# EasyEDA Pro project YanXi_Project.eprj, schematic PayloadBoard

## Sheets
1 电调主控: Create Date: 2023-04-20; Page Name: 电调主控; Project Name: YanXi_Project; Schematic Name: PayloadBoard; Update Date: 2023-07-10; Company: 嘉立创EDA; Drawed: WANG BIN; Page Size: A4; Version: V1.0
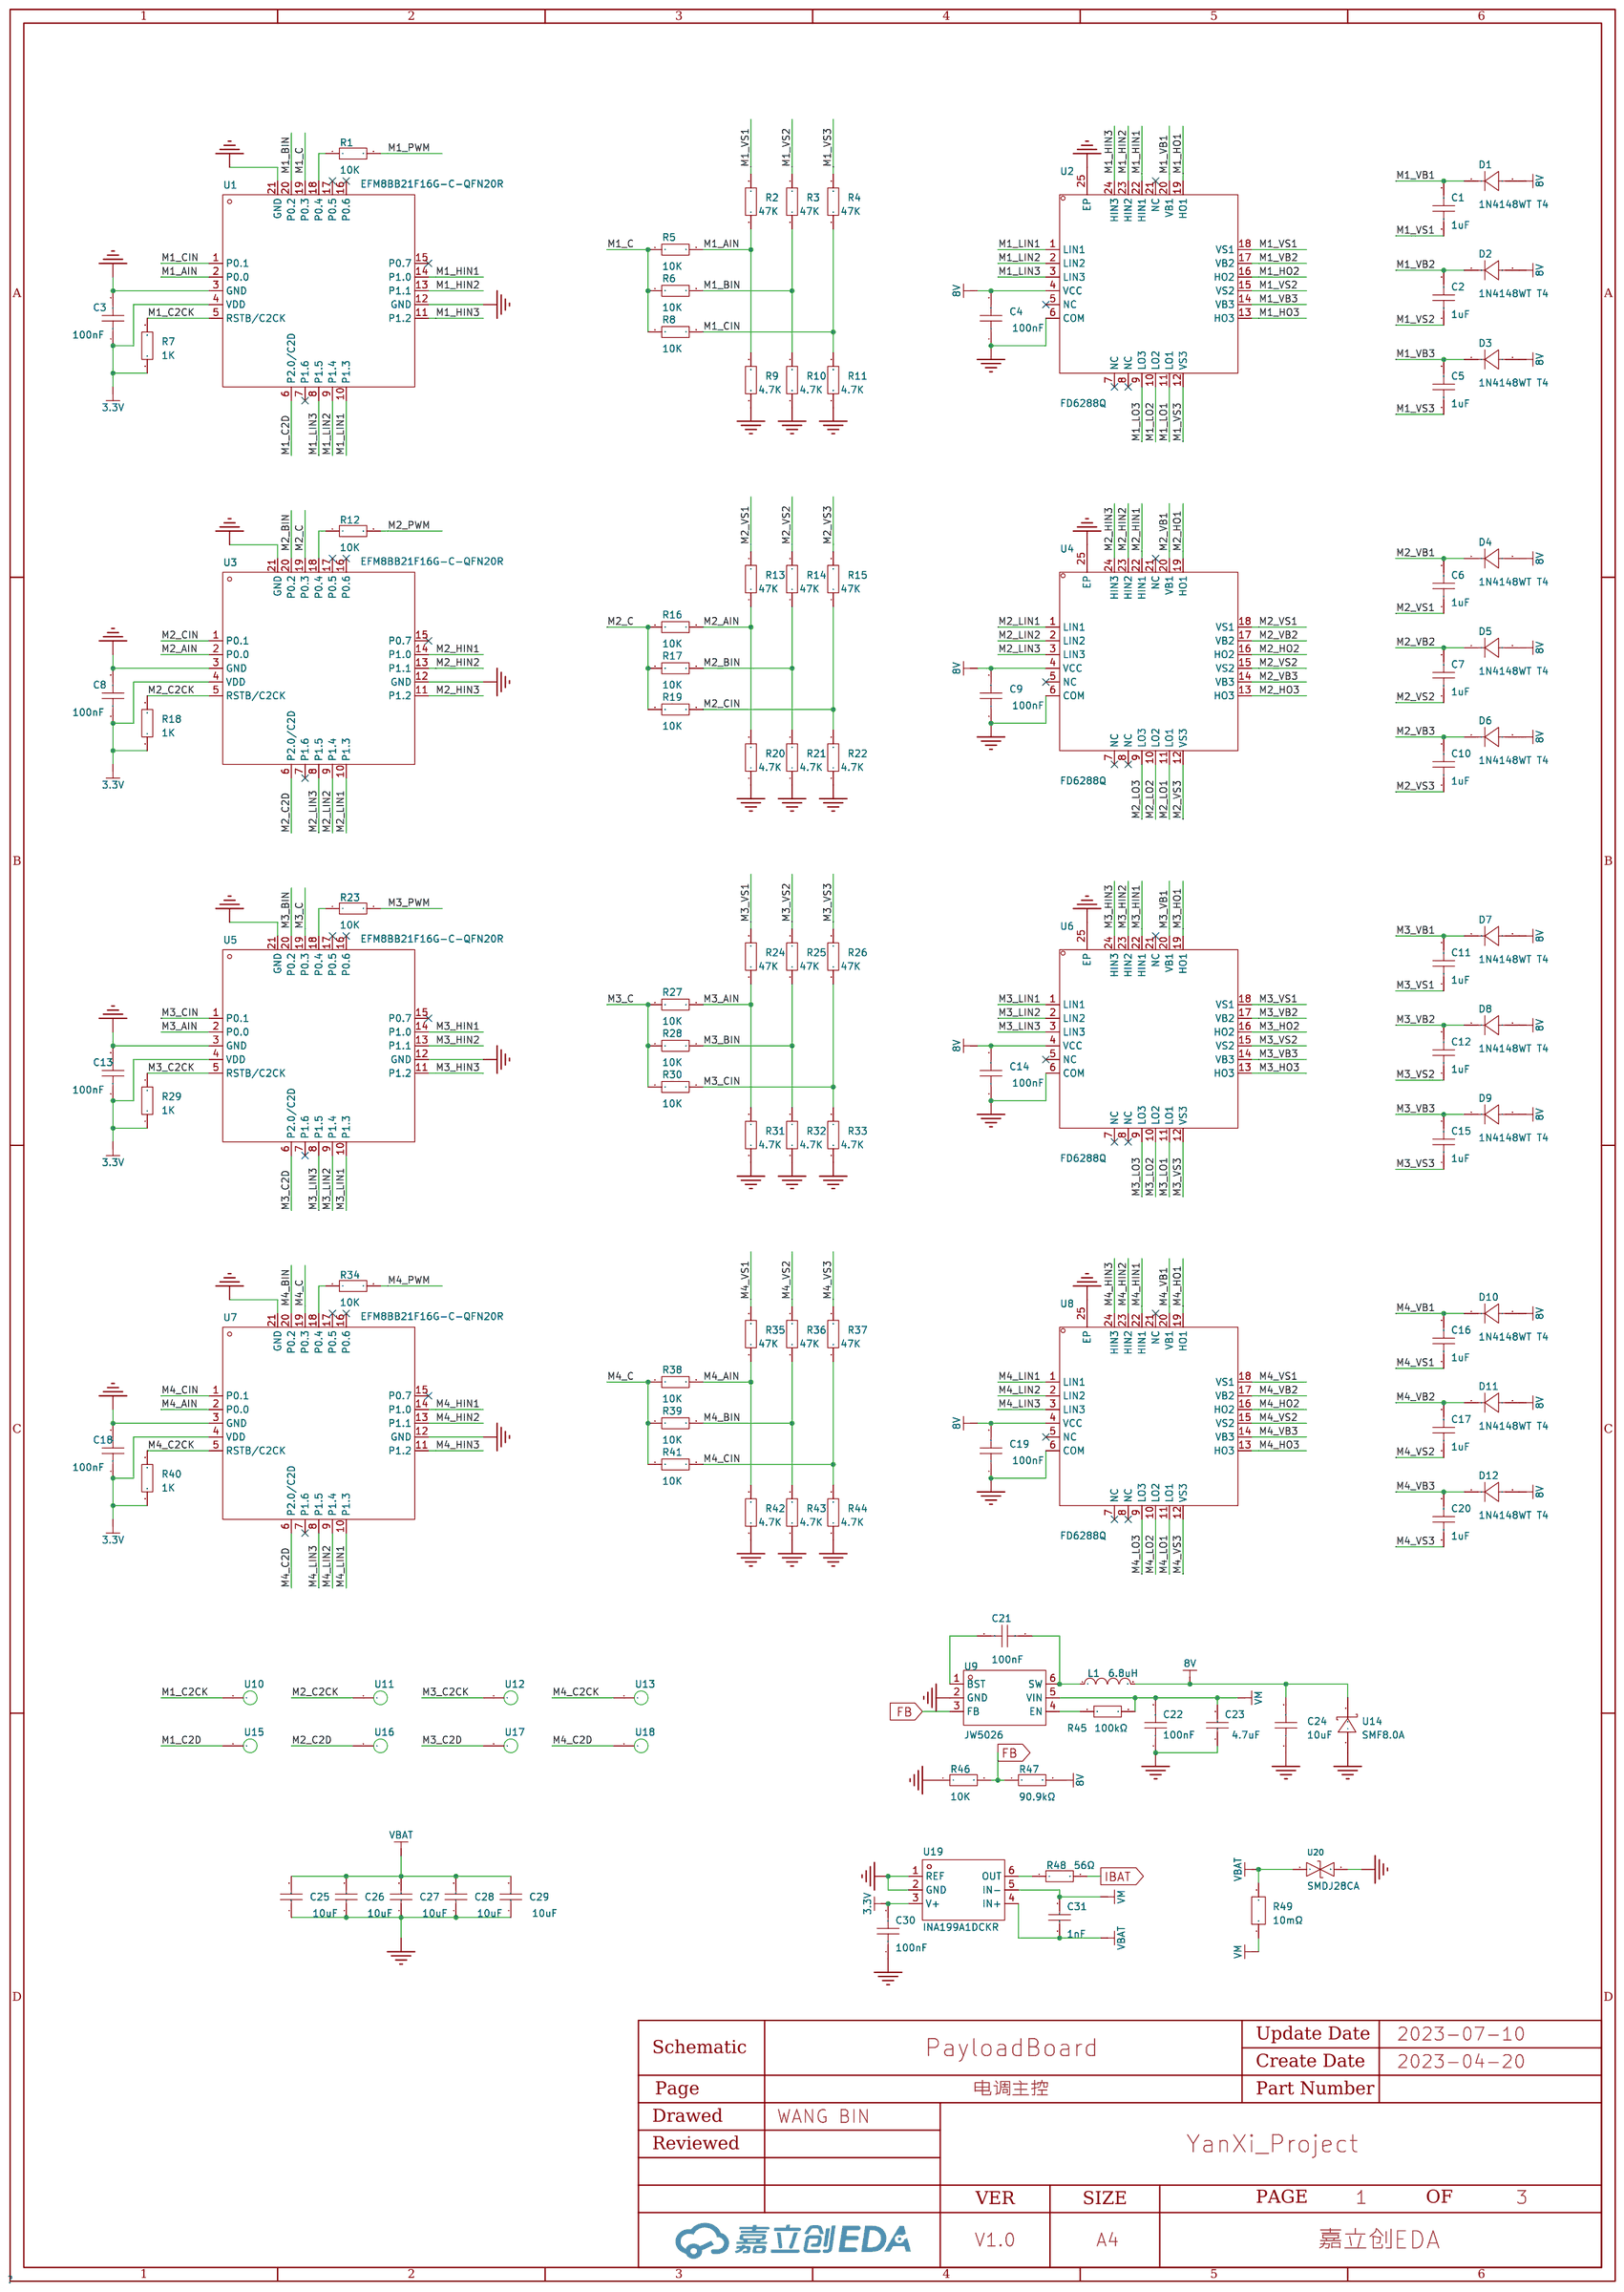
[diagram p0: 电调主控]
2 接插件: Page Name: 接插件; Update Date: 2023-07-11
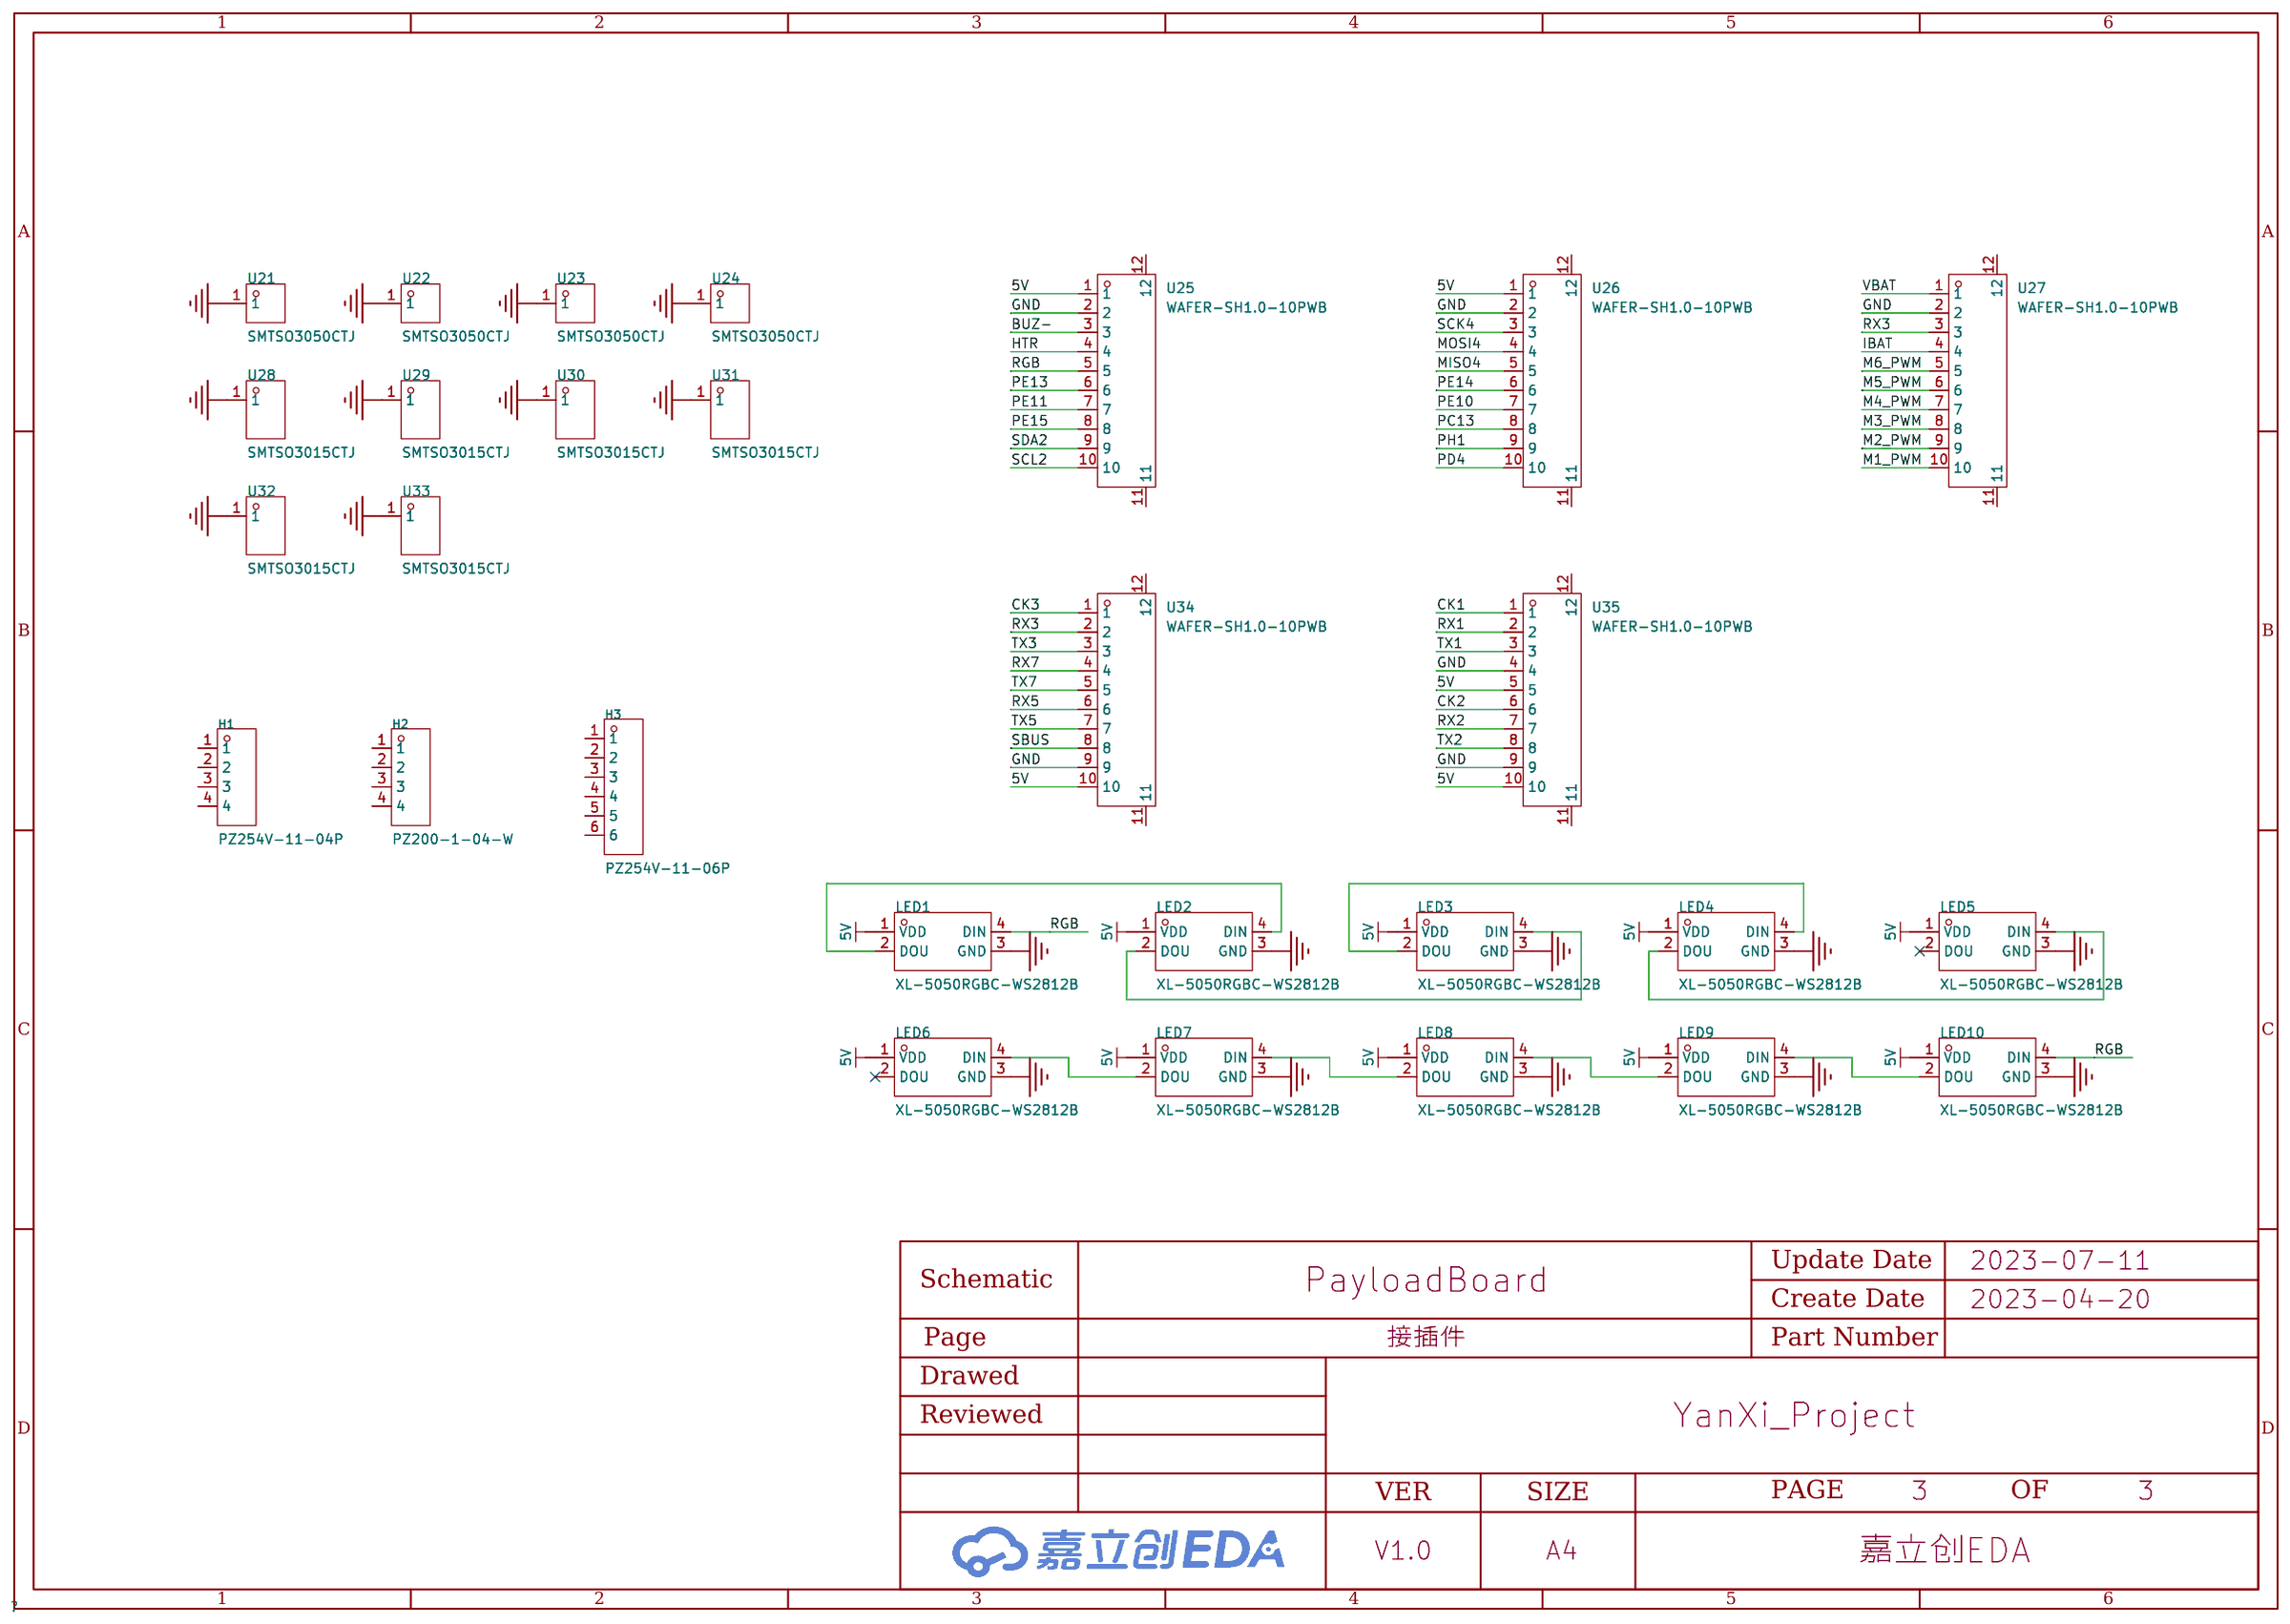
[diagram p1: 接插件]
3 电调驱动: Create Date: 2023-07-10; Page Name: 电调驱动
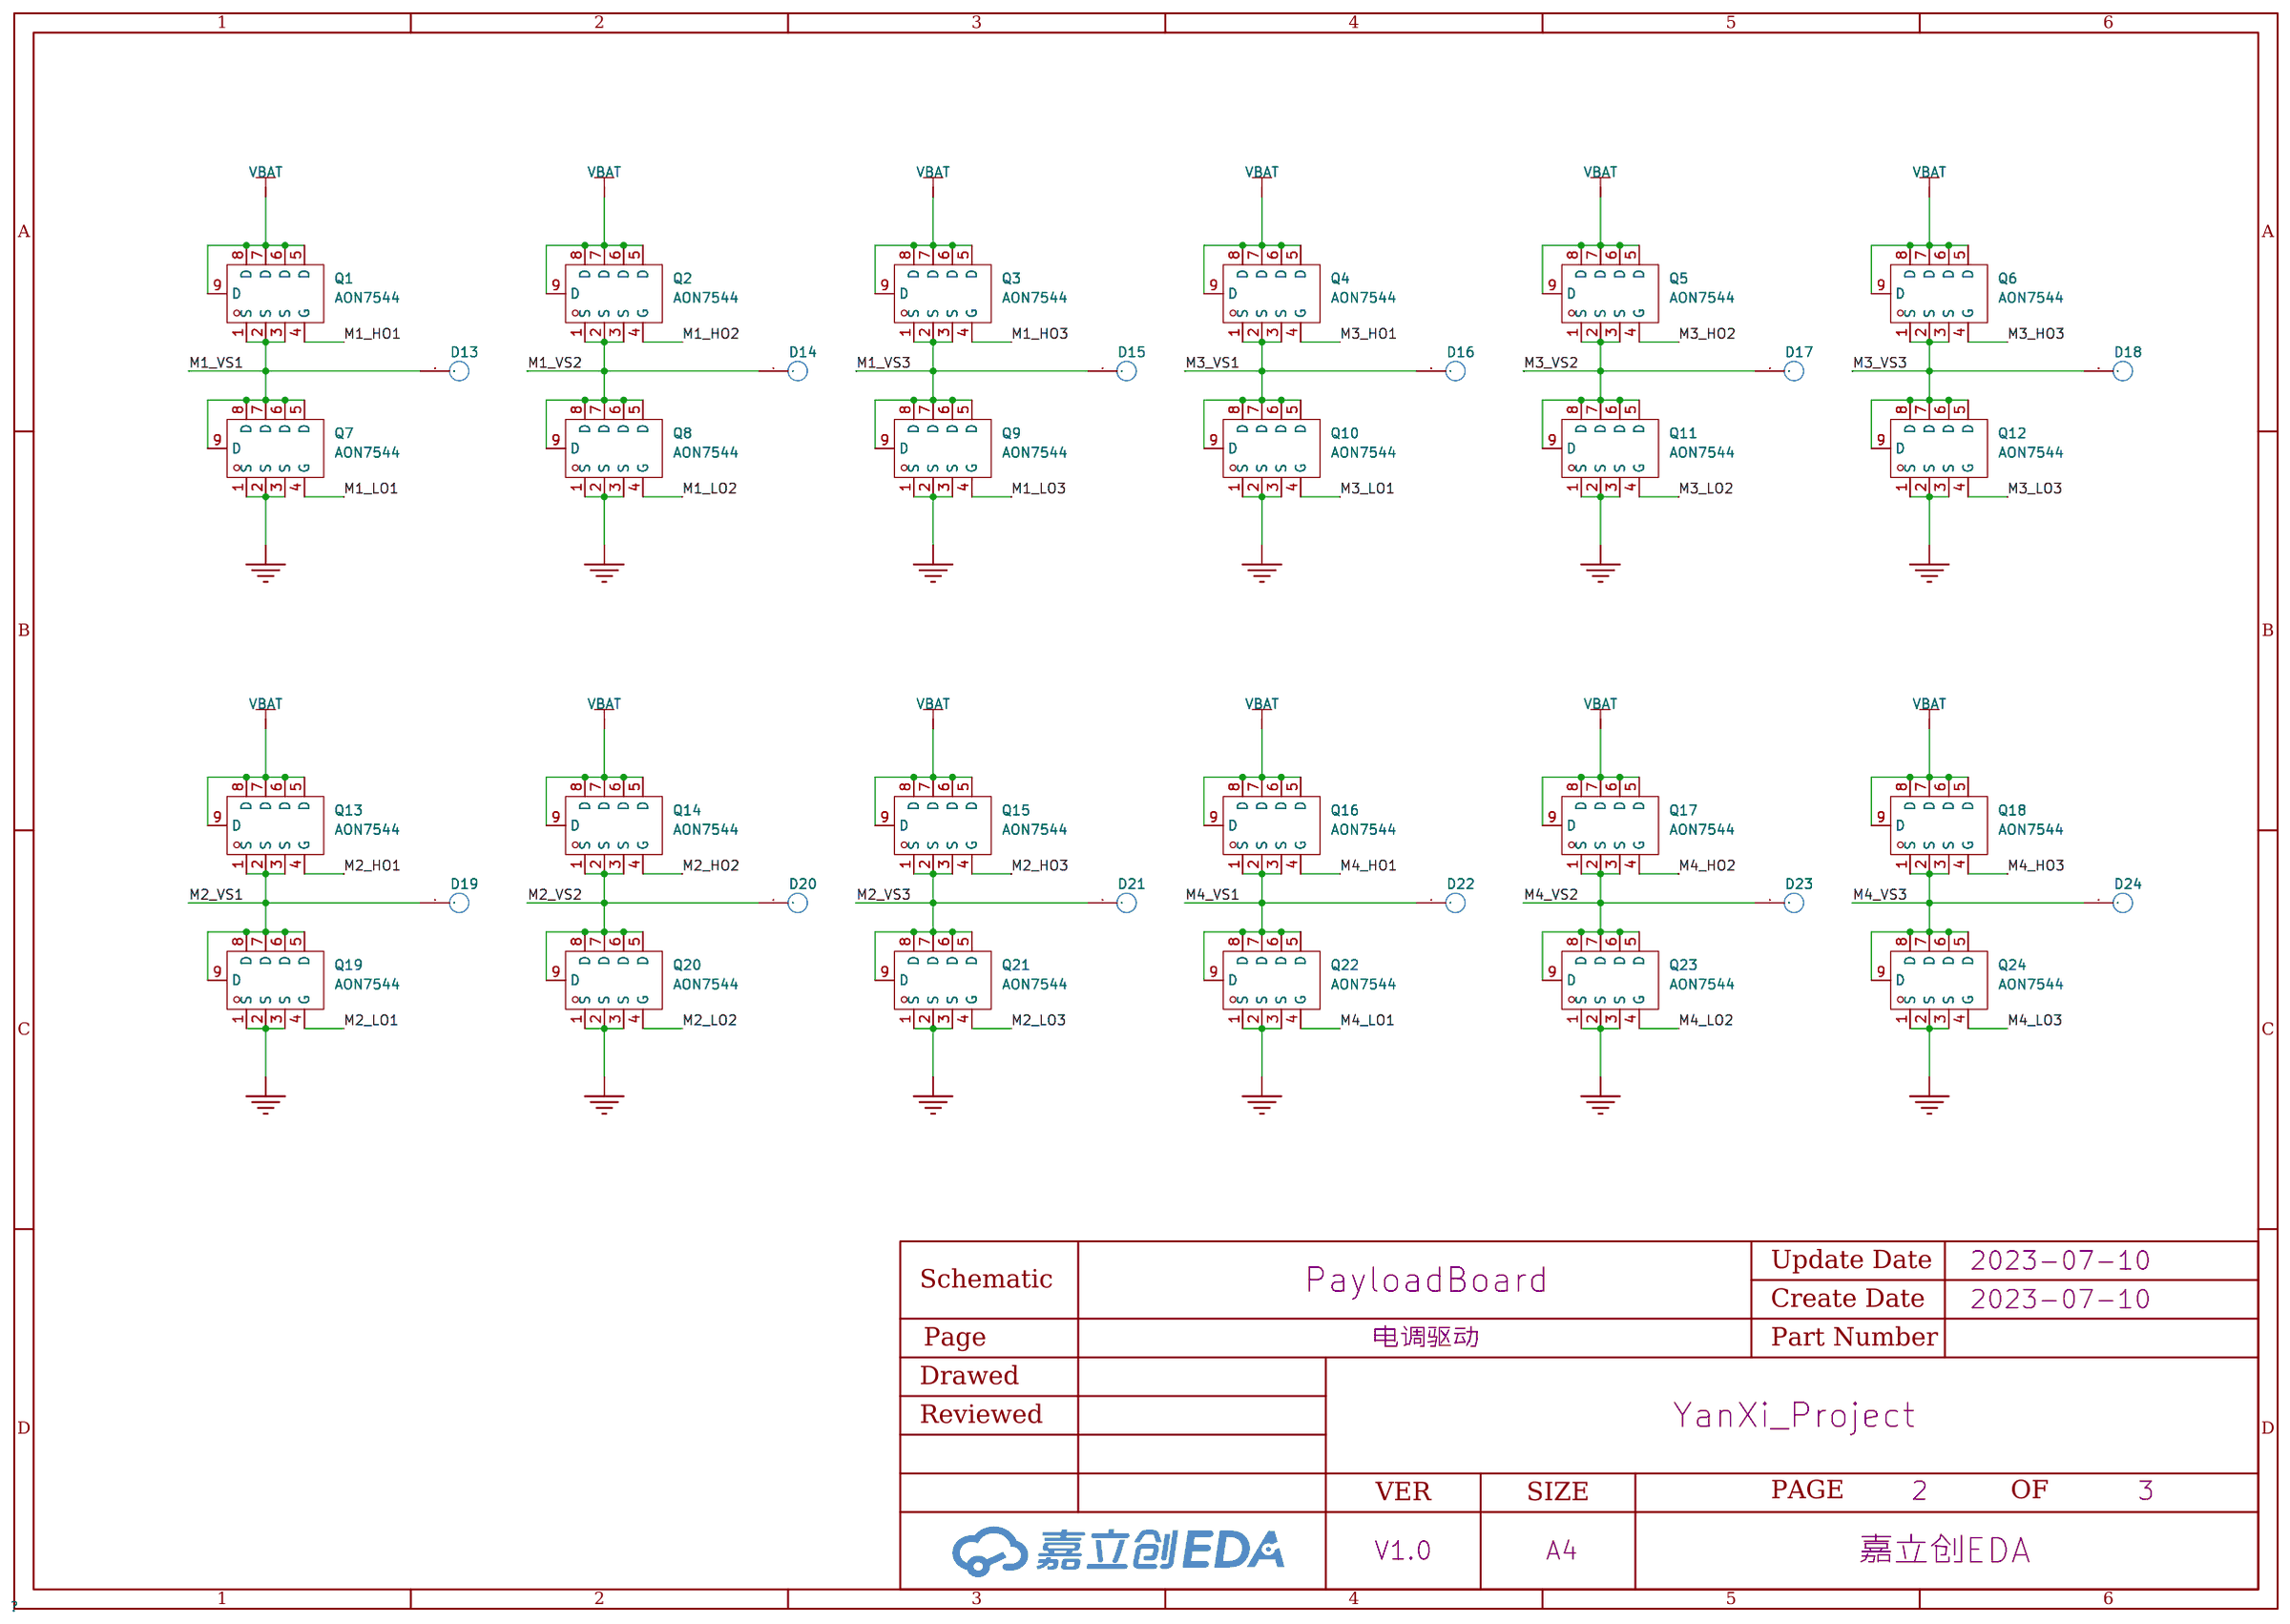
[diagram p2: 电调驱动]

## Parts
sheet 接插件
H1  PZ254V-11-04P  [HDR-TH_4P-P2.54-V-M]
H2  PZ200-1-04-W  [HDR-TH_4P-P2.00-H-M-W7.2-N]
H3  PZ254V-11-06P  [HDR-TH_6P-P2.54-V-M]
LED1  XL-5050RGBC-WS2812B  [LED-SMD_4P-L5.0-W5.0-BL_XL-5050RGBC]
LED2  XL-5050RGBC-WS2812B  [LED-SMD_4P-L5.0-W5.0-BL_XL-5050RGBC]
LED3  XL-5050RGBC-WS2812B  [LED-SMD_4P-L5.0-W5.0-BL_XL-5050RGBC]
LED4  XL-5050RGBC-WS2812B  [LED-SMD_4P-L5.0-W5.0-BL_XL-5050RGBC]
LED5  XL-5050RGBC-WS2812B  [LED-SMD_4P-L5.0-W5.0-BL_XL-5050RGBC]
LED6  XL-5050RGBC-WS2812B  [LED-SMD_4P-L5.0-W5.0-BL_XL-5050RGBC]
LED7  XL-5050RGBC-WS2812B  [LED-SMD_4P-L5.0-W5.0-BL_XL-5050RGBC]
LED8  XL-5050RGBC-WS2812B  [LED-SMD_4P-L5.0-W5.0-BL_XL-5050RGBC]
LED9  XL-5050RGBC-WS2812B  [LED-SMD_4P-L5.0-W5.0-BL_XL-5050RGBC]
LED10  XL-5050RGBC-WS2812B  [LED-SMD_4P-L5.0-W5.0-BL_XL-5050RGBC]
U21  SMTSO3050CTJ  [SMD_SMTSO3060CTJ]
U22  SMTSO3050CTJ  [SMD_SMTSO3060CTJ]
U23  SMTSO3050CTJ  [SMD_SMTSO3060CTJ]
U24  SMTSO3050CTJ  [SMD_SMTSO3060CTJ]
U25  WAFER-SH1.0-10PWB  [CONN-SMD_10P-P1.00_WAFER-SH1.0-10PWB]
U26  WAFER-SH1.0-10PWB  [CONN-SMD_10P-P1.00_WAFER-SH1.0-10PWB]
U27  WAFER-SH1.0-10PWB  [CONN-SMD_10P-P1.00_WAFER-SH1.0-10PWB]
U28  SMTSO3015CTJ  [SMD_BD5.6-L5.6-W5.6-D4.1]
U29  SMTSO3015CTJ  [SMD_BD5.6-L5.6-W5.6-D4.1]
U30  SMTSO3015CTJ  [SMD_BD5.6-L5.6-W5.6-D4.1]
U31  SMTSO3015CTJ  [SMD_BD5.6-L5.6-W5.6-D4.1]
U32  SMTSO3015CTJ  [SMD_BD5.6-L5.6-W5.6-D4.1]
U33  SMTSO3015CTJ  [SMD_BD5.6-L5.6-W5.6-D4.1]
U34  WAFER-SH1.0-10PWB  [CONN-SMD_10P-P1.00_WAFER-SH1.0-10PWB]
U35  WAFER-SH1.0-10PWB  [CONN-SMD_10P-P1.00_WAFER-SH1.0-10PWB]
sheet 电调主控
C1  1uF  [C0402]
C2  1uF  [C0402]
C3  100nF  [C0402_NEW]
C4  100nF  [C0402_NEW]
C5  1uF  [C0402]
C6  1uF  [C0402]
C7  1uF  [C0402]
C8  100nF  [C0402_NEW]
C9  100nF  [C0402_NEW]
C10  1uF  [C0402]
C11  1uF  [C0402]
C12  1uF  [C0402]
C13  100nF  [C0402_NEW]
C14  100nF  [C0402_NEW]
C15  1uF  [C0402]
C16  1uF  [C0402]
C17  1uF  [C0402]
C18  100nF  [C0402_NEW]
C19  100nF  [C0402_NEW]
C20  1uF  [C0402]
C21  100nF  [C0402_NEW]
C22  100nF  [C0402_NEW]
C23  4.7uF  [C0603]
C24  10uF  [C0603]
C25  10uF  [C1206]
C26  10uF  [C1206]
C27  10uF  [C1206]
C28  10uF  [C1206]
C29  10uF  [C1206]
C30  100nF  [C0402_NEW]
C31  1nF  [C0402]
D1  1N4148WT T4  [SOD-523_L1.2-W0.8-LS1.6-RD]
D2  1N4148WT T4  [SOD-523_L1.2-W0.8-LS1.6-RD]
D3  1N4148WT T4  [SOD-523_L1.2-W0.8-LS1.6-RD]
D4  1N4148WT T4  [SOD-523_L1.2-W0.8-LS1.6-RD]
D5  1N4148WT T4  [SOD-523_L1.2-W0.8-LS1.6-RD]
D6  1N4148WT T4  [SOD-523_L1.2-W0.8-LS1.6-RD]
D7  1N4148WT T4  [SOD-523_L1.2-W0.8-LS1.6-RD]
D8  1N4148WT T4  [SOD-523_L1.2-W0.8-LS1.6-RD]
D9  1N4148WT T4  [SOD-523_L1.2-W0.8-LS1.6-RD]
D10  1N4148WT T4  [SOD-523_L1.2-W0.8-LS1.6-RD]
D11  1N4148WT T4  [SOD-523_L1.2-W0.8-LS1.6-RD]
D12  1N4148WT T4  [SOD-523_L1.2-W0.8-LS1.6-RD]
L1  6.8uH  [L0805]
R1  10K  [R0402]
R2  47K  [R0402]
R3  47K  [R0402]
R4  47K  [R0402]
R5  10K  [R0402]
R6  10K  [R0402]
R7  1K  [R0402]
R8  10K  [R0402]
R9  4.7K  [R0402]
R10  4.7K  [R0402]
R11  4.7K  [R0402]
R12  10K  [R0402]
R13  47K  [R0402]
R14  47K  [R0402]
R15  47K  [R0402]
R16  10K  [R0402]
R17  10K  [R0402]
R18  1K  [R0402]
R19  10K  [R0402]
R20  4.7K  [R0402]
R21  4.7K  [R0402]
R22  4.7K  [R0402]
R23  10K  [R0402]
R24  47K  [R0402]
R25  47K  [R0402]
R26  47K  [R0402]
R27  10K  [R0402]
R28  10K  [R0402]
R29  1K  [R0402]
R30  10K  [R0402]
R31  4.7K  [R0402]
R32  4.7K  [R0402]
R33  4.7K  [R0402]
R34  10K  [R0402]
R35  47K  [R0402]
R36  47K  [R0402]
R37  47K  [R0402]
R38  10K  [R0402]
R39  10K  [R0402]
R40  1K  [R0402]
R41  10K  [R0402]
R42  4.7K  [R0402]
R43  4.7K  [R0402]
R44  4.7K  [R0402]
R45  100kΩ  [R0402]
R46  10K  [R0402]
R47  90.9kΩ  [R0402]
R48  56Ω  [R0402]
R49  10mΩ  [R1225]
U1  EFM8BB21F16G-C-QFN20R  [QFN-20_L3.0-W3.0-P0.50-BL-EP1.7_EFM8BB21F16G]
U2  FD6288Q  [QFN-24_L4.0-W4.0-P0.50-BL-EP2.6]
U3  EFM8BB21F16G-C-QFN20R  [QFN-20_L3.0-W3.0-P0.50-BL-EP1.7_EFM8BB21F16G]
U4  FD6288Q  [QFN-24_L4.0-W4.0-P0.50-BL-EP2.6]
U5  EFM8BB21F16G-C-QFN20R  [QFN-20_L3.0-W3.0-P0.50-BL-EP1.7_EFM8BB21F16G]
U6  FD6288Q  [QFN-24_L4.0-W4.0-P0.50-BL-EP2.6]
U7  EFM8BB21F16G-C-QFN20R  [QFN-20_L3.0-W3.0-P0.50-BL-EP1.7_EFM8BB21F16G]
U8  FD6288Q  [QFN-24_L4.0-W4.0-P0.50-BL-EP2.6]
U9  JW5026  [SOT-23-6_L2.9-W1.6-P0.95-LS2.8-BR]
U10  -  [烧录点]
U11  -  [烧录点]
U12  -  [烧录点]
U13  -  [烧录点]
U14  SMF8.0A  [SOD-123FL_L2.8-W1.8-LS3.6-RD]
U15  -  [烧录点]
U16  -  [烧录点]
U17  -  [烧录点]
U18  -  [烧录点]
U19  INA199A1DCKR  [SC-70-6_L2.2-W1.3-P0.65-LS2.1-BR]
U20  SMDJ28CA  [SMC_L6.9-W5.9-LS7.9-BI]
sheet 电调驱动
D13  -  [端口]
D14  -  [端口]
D15  -  [端口]
D16  -  [端口]
D17  -  [端口]
D18  -  [端口]
D19  -  [端口]
D20  -  [端口]
D21  -  [端口]
D22  -  [端口]
D23  -  [端口]
D24  -  [端口]
Q1  AON7544  [DFN-8_L3.0-W3.0-P0.65-BL]
Q2  AON7544  [DFN-8_L3.0-W3.0-P0.65-BL]
Q3  AON7544  [DFN-8_L3.0-W3.0-P0.65-BL]
Q4  AON7544  [DFN-8_L3.0-W3.0-P0.65-BL]
Q5  AON7544  [DFN-8_L3.0-W3.0-P0.65-BL]
Q6  AON7544  [DFN-8_L3.0-W3.0-P0.65-BL]
Q7  AON7544  [DFN-8_L3.0-W3.0-P0.65-BL]
Q8  AON7544  [DFN-8_L3.0-W3.0-P0.65-BL]
Q9  AON7544  [DFN-8_L3.0-W3.0-P0.65-BL]
Q10  AON7544  [DFN-8_L3.0-W3.0-P0.65-BL]
Q11  AON7544  [DFN-8_L3.0-W3.0-P0.65-BL]
Q12  AON7544  [DFN-8_L3.0-W3.0-P0.65-BL]
Q13  AON7544  [DFN-8_L3.0-W3.0-P0.65-BL]
Q14  AON7544  [DFN-8_L3.0-W3.0-P0.65-BL]
Q15  AON7544  [DFN-8_L3.0-W3.0-P0.65-BL]
Q16  AON7544  [DFN-8_L3.0-W3.0-P0.65-BL]
Q17  AON7544  [DFN-8_L3.0-W3.0-P0.65-BL]
Q18  AON7544  [DFN-8_L3.0-W3.0-P0.65-BL]
Q19  AON7544  [DFN-8_L3.0-W3.0-P0.65-BL]
Q20  AON7544  [DFN-8_L3.0-W3.0-P0.65-BL]
Q21  AON7544  [DFN-8_L3.0-W3.0-P0.65-BL]
Q22  AON7544  [DFN-8_L3.0-W3.0-P0.65-BL]
Q23  AON7544  [DFN-8_L3.0-W3.0-P0.65-BL]
Q24  AON7544  [DFN-8_L3.0-W3.0-P0.65-BL]

## Library data of the parts
H1 = PZ254V-11-04P: 排数:单排;总PIN位数:4P;间距:2.54mm;插针结构:1x4P;行距:-;安装类型:直插;圆针/方针:方针;额定电流:3A;额定电压:250V;配合针长度:6mm;塑高:2.5mm;端接针长度:3mm;触头材质:-;工作温度范围:-40℃~+105℃;颜色:黑色;; LCSC Part Name: 2.54mm 1x4P 直插 方针; Supplier Part: C2691448; Manufacturer: XFCN(兴飞); Supplier Footprint: 插件,P=2.54mm; JLCPCB Part Class: Extended Part; Datasheet: https://atta.szlcsc.com/upload/public/pdf/source/20200309/C492403_F9F19131791D08044AD4F84F8E751A34.pdf; Supplier: LCSC; Number of Rows: 单排; Number of Pins: 4P; Pitch: 2.54mm; Pin Structure: 1x4P; Mounting Type: 直插; Circluar Pins/Square Pins: 方针; Current Rating (Max): 3A; Voltage Rating (Max): 250V; Length of Mating Pin: 6mm; Insulation Height: 2.5mm; Length of End Connection Pin: 3mm; Operating Temperature Range: -40℃~+105℃; Color: 黑色
H2 = PZ200-1-04-W: 排数:单排;总PIN位数:4P;间距:2mm;插针结构:1x4P;行距:-;安装类型:弯插;圆针/方针:方针;额定电流:1.5A;额定电压:-;配合针长度:4mm;塑高:2mm;端接针长度:-;工作温度范围:-40℃~+105℃;颜色:黑色;; LCSC Part Name: 2mm 1x4P 弯插 方针; Supplier Part: C2905970; Manufacturer: HCTL(华灿天禄); Supplier Footprint: 弯插,P=2mm; JLCPCB Part Class: 扩展库; Datasheet: https://atta.szlcsc.com/upload/public/pdf/source/20230609/BDACCFE63111542B7350342186B24E54.pdf; Supplier: LCSC; Number of Rows: 单排; Number of Pins: 4P; Pitch: 2mm; Pin Structure: 1x4P; Mounting Type: 弯插; Circluar Pins/Square Pins: 方针; Current Rating (Max): 1.5A; Length of Mating Pin: 4mm; Insulation Height: 2mm; Operating Temperature Range: -40℃~+105℃; Color: 黑色
H3 = PZ254V-11-06P: 排数:单排;总PIN位数:6;间距:2.54mm;插针结构:1x6P;行距:-;安装类型:直插;圆针/方针:方针;额定电流:-;额定电压:-;配合针长度:6mm;塑高:2.5mm;端接针长度:3mm;触头材质:黄铜;触头镀层:-;工作温度范围:-40℃~+105℃;颜色:黑色;; LCSC Part Name: 2.54mm 1x6P 直插 方针; Supplier Part: C492405; Manufacturer: XFCN(兴飞); Supplier Footprint: 直插,P=2.54mm; JLCPCB Part Class: 扩展库; Supplier: LCSC; Number of Rows: 单排; Number of Pins: 6; Pitch: 2.54mm; Pin Structure: 1x6P; Mounting Type: 直插; Circluar Pins/Square Pins: 方针; Length of Mating Pin: 6mm; Insulation Height: 2.5mm; Length of End Connection Pin: 3mm; Contact Material: 黄铜; Operating Temperature Range: -40℃~+105℃; Color: 黑色
LED1-LED10 = XL-5050RGBC-WS2812B: 发光颜色:RGB三色;二极管配置:-;主波长:-;色温:-;功率:-;安装方式:正贴;; LCSC Part Name: RGB三色 正贴 幻彩; Supplier Part: C2843785; Manufacturer: XINGLIGHT(成兴光); Supplier Footprint: SMD5050; JLCPCB Part Class: 扩展库; Datasheet: https://atta.szlcsc.com/upload/public/pdf/source/20230111/86AAD2096485A2E5BCAB883FF8CBE6FD.pdf; Supplier: LCSC; Emitted Color: RGB三色; Lens Color: 无色透明; Peak Wavelength: 625nm；470nm；530nm; Viewing Angle: 120°; Mounting Sytle: 正贴; Operating Temperature: -30℃~+70℃
U21-U24 = SMTSO3050CTJ: M3x5.56xL5+1.53; LCSC Part Name: 雄和远景，电路板表贴圆螺母柱，M3X5，铜镀锡; Supplier Part: C2915636; Manufacturer: Sinhoo(雄和远景); JLCPCB Part Class: Extended Part; Datasheet: https://atta.szlcsc.com/upload/public/pdf/source/20211122/17CF5E24EB4D4DC090A80DE3D7DE5E21.pdf; Supplier: LCSC
U25-U27 U34 U35 = WAFER-SH1.0-10PWB: 间距:1mm;插针结构:1x10P;排数:1;每排PIN数:10;公母:公型插针;安装方式:卧贴;额定电流:1A;工作温度范围:-25℃~+85℃;; LCSC Part Name: 1mm 1x10P 卧贴; Supplier Part: C3029349; Manufacturer: XUNPU(讯普); Supplier Footprint: SMD,P=1mm; JLCPCB Part Class: 扩展库; Datasheet: https://atta.szlcsc.com/upload/public/pdf/source/20220527/1879B8210BD3B2006BCEAC1A40D397B6.pdf; Supplier: LCSC; Pitch: 1mm; Pins Structure: 1x10P; Number of Rows: 1; Number of PINs Per Row: 10; Gender: 公型插针; Mounting Style: 卧贴; Current Rating (Max): 1A; Operating Temperature Range: -25℃~+85℃
U28-U33 = SMTSO3015CTJ: M3x5.56xL1.5+1.53; LCSC Part Name: 雄和远景，电路板表贴圆螺母柱，M3X1.5，铜镀锡; Supplier Part: C2915632; Manufacturer: Sinhoo(雄和远景); JLCPCB Part Class: Extended Part; Datasheet: https://atta.szlcsc.com/upload/public/pdf/source/20211122/17CF5E24EB4D4DC090A80DE3D7DE5E21.pdf; Supplier: LCSC
C1 C2 C5-C7 C10-C12 C15-C17 C20 = CL05A105KA5NQNC: 容值:1uF;精度:±10%;额定电压:25V;材质(温度系数):X5R;; LCSC Part Name: 1uF ±10% 25V; Supplier Part: C52923; Manufacturer: SAMSUNG(三星); Supplier Footprint: 0402; JLCPCB Part Class: Basic Part; Datasheet: https://atta.szlcsc.com/upload/public/pdf/source/20160103/1457707735223.pdf; Supplier: LCSC; Tolerance: ±10%; Voltage Rated: 25V; Temperature Coefficient: X5R
C3 C4 C8 C9 C13 C14 C18 C19 C21 C22 C30 = CL05B104KO5NNNC: 容值:100nF;精度:±10%;额定电压:16V;材质(温度系数):X7R;; LCSC Part Name: 100nF ±10% 16V; Supplier Part: C1525; Manufacturer: SAMSUNG(三星); Supplier Footprint: 0402; JLCPCB Part Class: Basic Part; Datasheet: https://atta.szlcsc.com/upload/public/pdf/source/20160103/1457707674891.pdf; Supplier: LCSC; Tolerance: ±10%; Voltage Rated: 16V; Temperature Coefficient: X7R
C23 = CL10A475KO8NNNC: 容值:4.7uF;精度:±10%;额定电压:16V;材质(温度系数):X5R;; LCSC Part Name: 4.7uF ±10% 16V; Supplier Part: C19666; Manufacturer: SAMSUNG(三星); Supplier Footprint: 0603; JLCPCB Part Class: 基础库; Datasheet: https://atta.szlcsc.com/upload/public/pdf/source/20160103/1457707703134.pdf; Supplier: LCSC; Tolerance: ±10%; Voltage Rated: 16V; Temperature Coefficient: X5R
C24 = CL10A106KP8NNNC: 容值:10uF;精度:±10%;额定电压:10V;材质(温度系数):X5R;; LCSC Part Name: 10uF ±10% 10V; Supplier Part: C19702; Manufacturer: SAMSUNG(三星); Supplier Footprint: 0603; JLCPCB Part Class: 基础库; Datasheet: https://atta.szlcsc.com/upload/public/pdf/source/20160103/1457707703378.pdf; Supplier: LCSC; Tolerance: ±10%; Voltage Rated: 10V; Temperature Coefficient: X5R
C25-C29 = CL31A106KBHNNNE: 容值:10uF;精度:±10%;额定电压:50V;材质(温度系数):X5R;; LCSC Part Name: 10uF ±10% 50V; Supplier Part: C13585; Manufacturer: SAMSUNG(三星); Supplier Footprint: 1206; JLCPCB Part Class: Basic Part; Datasheet: https://atta.szlcsc.com/upload/public/pdf/source/20160103/1457707668742.pdf; Supplier: LCSC; Tolerance: ±10%; Voltage Rated: 50V; Temperature Coefficient: X5R
C31 = 0402B102K500NT: 容值:1nF;精度:±10%;额定电压:50V;材质(温度系数):X7R;; LCSC Part Name: 1nF ±10% 50V; Supplier Part: C1523; Manufacturer: FH(风华); Supplier Footprint: 0402; JLCPCB Part Class: 基础库; Datasheet: https://atta.szlcsc.com/upload/public/pdf/source/20200305/C486355_26A10D38EF8C2A5C37091D0039909270.pdf; Supplier: LCSC; Tolerance: ±10%; Voltage Rated: 50V; Temperature Coefficient: X7R
D1-D12 = 1N4148WT T4_C2828426: 二极管配置:独立式;功率:150mW;直流反向耐压(Vr):75V;平均整流电流(Io):125mA;正向压降(Vf):1.25V@150mA;反向电流(Ir):50A@75V;反向恢复时间(trr):4ns;工作温度:-65℃~+150℃@(Tj);; LCSC Part Name: 1N4148WT T4(T4表示丝印); Supplier Part: C2828426; Manufacturer: CBI(创基); Supplier Footprint: SOD-523; JLCPCB Part Class: Extended Part; Datasheet: https://atta.szlcsc.com/upload/public/pdf/source/20210506/C2828426_FE98390777A6881C4EE7D61E0D0F2EAB.pdf; Supplier: LCSC; Diode Configuration: 独立式; Power Dissipation: 150mW; Reverse Voltage (Vr): 75V; Average Rectified Current (Io): 125mA; Forward Voltage (Vf@If): 1.25V@150mA; Reverse Leakage Current: 50A@75V; Reverse Recovery Time (trr): 4ns; Operating Temperature: -65℃~+150℃@(Tj)
L1 = SDFL2012S6R8KTF: 电感值:6.8uH;精度:±10%;额定电流:15mA;饱和电流(Isat):-;直流电阻(DCR):1Ω;; LCSC Part Name: 6.8uH ±10% 1Ω; Supplier Part: C334249; Manufacturer: Sunlord(顺络); Supplier Footprint: 0805; JLCPCB Part Class: 扩展库; Datasheet: https://atta.szlcsc.com/upload/public/pdf/source/20210816/855F4348312D259031B87CBCF31BE802.pdf; Supplier: LCSC; Tolerance: ±10%; Rated Current: 15mA; DC Resistance (DCR): 1Ω
R1-R44 R46 = Res_0402: Supplier Footprint: 0402
R45 = 0402WGF1003TCE: 电阻类型:厚膜电阻;阻值:100kΩ;精度:±1%;功率:62.5mW;; LCSC Part Name: 100kΩ ±1% 62.5mW; Supplier Part: C25741; Manufacturer: UNI-ROYAL(厚声); Supplier Footprint: 0402; JLCPCB Part Class: 基础库; Datasheet: https://atta.szlcsc.com/upload/public/pdf/source/20200306/C422600_1E6D84923E4A46A82E41ADD87F860B5C.pdf; Supplier: LCSC; Type: 厚膜电阻; Tolerance: ±1%; Power(Watts): 62.5mW; Temperature Coefficient: ±100ppm/℃; Overload Voltage (Max): 50V; Operating Temperature Range: -55℃~+155℃
R47 = MCR01MZPF9092: 阻值:90.9kΩ;精度:±1%;; LCSC Part Name: 90.9kΩ ±1%; Supplier Part: C509684; Manufacturer: ROHM(罗姆); Supplier Footprint: 0402; JLCPCB Part Class: 扩展库; Datasheet: https://atta.szlcsc.com/upload/public/pdf/source/20201013/C162034_936196FAAEFF3303C247CEB32D3B2EAE.pdf; Supplier: LCSC; Tolerance: ±1%
R48 = 0402WGF560JTCE: 电阻类型:厚膜电阻;阻值:56Ω;精度:±1%;功率:62.5mW;; LCSC Part Name: 56Ω ±1% 62.5mW; Supplier Part: C25127; Manufacturer: UNI-ROYAL(厚声); Supplier Footprint: 0402; JLCPCB Part Class: Extended Part; Datasheet: https://atta.szlcsc.com/upload/public/pdf/source/20200306/C422600_1E6D84923E4A46A82E41ADD87F860B5C.pdf; Supplier: LCSC; Type: 厚膜电阻; Tolerance: ±1%; Power(Watts): 62.5mW; Temperature Coefficient: ±100ppm/℃; Overload Voltage (Max): 50V; Operating Temperature Range: -55℃~+155℃
R49 = CS25FTFR010: 电阻类型:采样电阻;阻值:10mΩ;精度:±1%;功率:3W;安装方式:贴片;; LCSC Part Name: 10mΩ ±1% 3W; Supplier Part: C304202; Manufacturer: Viking(光颉); Supplier Footprint: 1225; JLCPCB Part Class: 扩展库; Datasheet: https://atta.szlcsc.com/upload/public/pdf/source/20180929/C304202_F4401053E01A81C82EBE79F174402479.pdf; Supplier: LCSC; Type: 采样电阻; Rated Current: 31.6A; Tolerance: ±1%; Power(Watts): 3W; Temperature Coefficient: ±200ppm/℃; Mounting Sytle: 贴片
U1 U3 U5 U7 = EFM8BB21F16G-C-QFN20R: CPU内核:51系列;CPU最大主频:50MHz;工作电压范围:2.2V~3.6V;内部振荡器:有;程序 FLASH容量:16K@x8bit;RAM总容量:2.25KB;EEPROM/数据 FLASH容量:-;GPIO端口数量:16;ADC(单元数/通道数/位数):1@x15ch/12bit;外设/功能/协议栈:看门狗；PWM;工作温度范围:-40℃~+85℃;; LCSC Part Name: 51系列 50MHz 闪存：16K@x8bit RAM：2.25KB; Supplier Part: C80713; Manufacturer: SILICON LABS(芯科); Supplier Footprint: QFN-20-EP(3x3); JLCPCB Part Class: Extended Part; Datasheet: https://atta.szlcsc.com/upload/public/pdf/source/20160823/1471947533781.pdf; Supplier: LCSC; CPU Core: 51系列; Maximum Frequency: 50MHz; Supply Voltage Range: 2.2V~3.6V; Internal Oscillator: 有; Program FLASH Size: 16K@x8bit; RAM Size: 2.25KB; GPIO Ports Number: 16; ADC (Units/Channels/bits): 1@x15ch/12bit; Peripherals / Functions / Protocol Stacks: 看门狗；PWM; Operating Temperature Range: -40℃~+85℃
U2 U4 U6 U8 = FD6288Q: Supplier Part: C328453; Manufacturer: Fortior Tech(峰岹); Supplier Footprint: QFN-24; JLCPCB Part Class: Extended Part; Datasheet: https://atta.szlcsc.com/upload/public/pdf/source/20181108/C328453_785547738DB9FC0123219FC22539EFAD.pdf; Supplier: LCSC
U9 = JW5026: 功能类型:降压型;同步整流:-;输出通道数:-;拓扑结构:-;输入电压:-;输出电流(最大值):-;开关频率:-;; LCSC Part Name: 降压型; Supplier Part: C185109; Manufacturer: Joulwatt(杰华特); Supplier Footprint: SOT-23-6; JLCPCB Part Class: 扩展库; Datasheet: https://atta.szlcsc.com/upload/public/pdf/source/20180404/C185109_F816213DAA4C443FF7F4B914D7806D86.pdf; Supplier: LCSC; Function: 降压型
U10-U13 U15-U18 = 烧录点
U14 = SMF8.0A_C2995287: 极性:单向;反向截止电压(Vrwm):8V;击穿电压:8.89V;最大钳位电压:13.6V;; LCSC Part Name: 单向 Vrwm:8V 200W; Supplier Part: C2995287; Manufacturer: MSKSEMI(美森科); Supplier Footprint: SOD-123FL; JLCPCB Part Class: 扩展库; Datasheet: https://atta.szlcsc.com/upload/public/pdf/source/20220518/25F9D6A9763007D5DDC974AB687754E7.pdf; Supplier: LCSC; Polarity: 单向; Reverse Stand-Off Voltage (Vrwm): 8V; Breakdown Voltage: 8.89V; Reverse Leakage Current (Ir): 25uA; Peak Pulse Current (Ipp)@10/1000μs: 14.7A; Maximum Clamping Voltage: 13.6V; Peak Pulse Power Dissipation (Ppp)@10/1000μs: 200W
U19 = INA199A1DCKR: INA199 26V、双向、零漂移、低侧/高侧、电压输出分流监控器; Supplier Part: C59135; Manufacturer: TI(德州仪器); Supplier Footprint: SC-70-6(SOT-363); JLCPCB Part Class: 扩展库; Datasheet: https://atta.szlcsc.com/upload/public/pdf/source/20150921/1457707392422.pdf; Supplier: LCSC
U20 = SMDJ28CA_C2990249: 反向截止电压(Vrwm):28V;击穿电压:31.1V;最大钳位电压:45.4V;; Supplier Part: C2990249; Manufacturer: Liown(里阳半导体); Supplier Footprint: SMC(DO-214AB); JLCPCB Part Class: 扩展库; Datasheet: https://atta.szlcsc.com/upload/public/pdf/source/20220518/06731CFA861C48FA41BB6B464E44C567.pdf; Supplier: LCSC; Reverse Stand-Off Voltage (Vrwm): 28V; Breakdown Voltage: 31.1V; Reverse Leakage Current (Ir): 1uA; Peak Pulse Current (Ipp)@10/1000us: 66.1A; Maximum Clamping Voltage: 45.4V; Peak Pulse Power Dissipation (Ppp)@10/1000us: 3kW
D13-D24 = 端口
Q1-Q24 = AON7544: 类型:N沟道;漏源电压(Vdss):30V;连续漏极电流(Id):30A;功率(Pd):23W;导通电阻(RDS(on)@Vgs,Id):5mΩ@10V,20A;阈值电压(Vgs(th)@Id):2.2V@250uA;; LCSC Part Name: N沟道 30V 30A; Supplier Part: C315567; Manufacturer: AOS; Supplier Footprint: DFN-8(3x3); JLCPCB Part Class: Extended Part; Datasheet: https://atta.szlcsc.com/upload/public/pdf/source/20190614/C315567_E434D67BCCEB23ABC813CC1BF26EA614.pdf; Supplier: LCSC; Type: N沟道; Drain Source Voltage (Vdss): 30V; Continuous Drain Current (Id): 30A; Power Dissipation (Pd): 23W; Drain Source On Resistance (RDS(on)@Vgs,Id): 5mΩ@10V,20A; Gate Threshold Voltage (Vgs(th)@Id): 2.2V@250uA

## Nets
3.3V: C3.1 C8.1 C13.1 C18.1 C30.2 R7.1 R18.1 R29.1 R40.1 U1.4(VDD) U3.4(VDD) U5.4(VDD) U7.4(VDD) U19.3(V+)
5V: LED1.1(VDD) LED2.1(VDD) LED3.1(VDD) LED4.1(VDD) LED5.1(VDD) LED6.1(VDD) LED7.1(VDD) LED8.1(VDD) LED9.1(VDD) LED10.1(VDD) U25.1 U26.1 U34.10 U35.5 U35.10
8V: C4.2 C9.2 C14.2 C19.2 C24.2 D1.2(A) D2.2(A) D3.2(A) D4.2(A) D5.2(A) D6.2(A) D7.2(A) D8.2(A) D9.2(A) D10.2(A) D11.2(A) D12.2(A) L1.2 R47.2 U2.4(VCC) U4.4(VCC) U6.4(VCC) U8.4(VCC) U14.1(K)
GND: C3.2 C4.1 C8.2 C9.1 C13.2 C14.1 C18.2 C19.1 C22.1 C23.1 C24.1 C25.1 C26.1 C27.1 C28.1 C29.1 C30.1 LED1.3(GND) LED2.3(GND) LED3.3(GND) LED4.3(GND) LED5.3(GND) LED6.3(GND) LED7.3(GND) LED8.3(GND) LED9.3(GND) LED10.3(GND) Q7.1(S) Q7.2(S) Q7.3(S) Q8.1(S) Q8.2(S) Q8.3(S) Q9.1(S) Q9.2(S) Q9.3(S) Q10.1(S) Q10.2(S) Q10.3(S) Q11.1(S) Q11.2(S) Q11.3(S) Q12.1(S) Q12.2(S) Q12.3(S) Q19.1(S) Q19.2(S) Q19.3(S) Q20.1(S) Q20.2(S) Q20.3(S) Q21.1(S) Q21.2(S) Q21.3(S) Q22.1(S) Q22.2(S) Q22.3(S) Q23.1(S) Q23.2(S) Q23.3(S) Q24.1(S) Q24.2(S) Q24.3(S) R9.1 R10.1 R11.1 R20.1 R21.1 R22.1 R31.1 R32.1 R33.1 R42.1 R43.1 R44.1 R46.1 U1.3(GND) U1.12(GND) U1.21(GND) U2.6(COM) U2.25(EP) U3.3(GND) U3.12(GND) U3.21(GND) U4.6(COM) U4.25(EP) U5.3(GND) U5.12(GND) U5.21(GND) U6.6(COM) U6.25(EP) U7.3(GND) U7.12(GND) U7.21(GND) U8.6(COM) U8.25(EP) U9.2(GND) U14.2(A) U19.1(REF) U19.2(GND) U20.2 U21.1 U22.1 U23.1 U24.1 U25.2 U26.2 U27.2 U28.1 U29.1 U30.1 U31.1 U32.1 U33.1 U34.9 U35.4 U35.9
VBAT: C25.2 C26.2 C27.2 C28.2 C29.2 C31.1 Q1.5(D) Q1.6(D) Q1.7(D) Q1.8(D) Q1.9(D) Q2.5(D) Q2.6(D) Q2.7(D) Q2.8(D) Q2.9(D) Q3.5(D) Q3.6(D) Q3.7(D) Q3.8(D) Q3.9(D) Q4.5(D) Q4.6(D) Q4.7(D) Q4.8(D) Q4.9(D) Q5.5(D) Q5.6(D) Q5.7(D) Q5.8(D) Q5.9(D) Q6.5(D) Q6.6(D) Q6.7(D) Q6.8(D) Q6.9(D) Q13.5(D) Q13.6(D) Q13.7(D) Q13.8(D) Q13.9(D) Q14.5(D) Q14.6(D) Q14.7(D) Q14.8(D) Q14.9(D) Q15.5(D) Q15.6(D) Q15.7(D) Q15.8(D) Q15.9(D) Q16.5(D) Q16.6(D) Q16.7(D) Q16.8(D) Q16.9(D) Q17.5(D) Q17.6(D) Q17.7(D) Q17.8(D) Q17.9(D) Q18.5(D) Q18.6(D) Q18.7(D) Q18.8(D) Q18.9(D) R49.2 U19.4(IN+) U20.1 U27.1
BUZ-: U25.3
CK1: U35.1
CK2: U35.6
CK3: U34.1
FB: R46.2 R47.1 U9.3(FB)
HTR: U25.4
IBAT: R48.2 U27.4
M1_AIN: R2.1 R5.2 R9.2 U1.2(P0.0)
M1_BIN: R3.1 R6.2 R10.2 U1.20(P0.2)
M1_C: R5.1 R6.1 R8.1 U1.19(P0.3)
M1_C2CK: R7.2 U1.5(RSTB/C2CK) U10.1
M1_C2D: U1.6(P2.0/C2D) U15.1
M1_CIN: R4.1 R8.2 R11.2 U1.1(P0.1)
M1_HIN1: U1.14(P1.0) U2.22(HIN1)
M1_HIN2: U1.13(P1.1) U2.23(HIN2)
M1_HIN3: U1.11(P1.2) U2.24(HIN3)
M1_HO1: Q1.4(G) U2.19(HO1)
M1_HO2: Q2.4(G) U2.16(HO2)
M1_HO3: Q3.4(G) U2.13(HO3)
M1_LIN1: U1.10(P1.3) U2.1(LIN1)
M1_LIN2: U1.9(P1.4) U2.2(LIN2)
M1_LIN3: U1.8(P1.5) U2.3(LIN3)
M1_LO1: Q7.4(G) U2.11(LO1)
M1_LO2: Q8.4(G) U2.10(LO2)
M1_LO3: Q9.4(G) U2.9(LO3)
M1_PWM: R1.2 U27.10
M1_VB1: C1.2 D1.1(K) U2.20(VB1)
M1_VB2: C2.2 D2.1(K) U2.17(VB2)
M1_VB3: C5.2 D3.1(K) U2.14(VB3)
M1_VS1: C1.1 D13.1 Q1.1(S) Q1.2(S) Q1.3(S) Q7.5(D) Q7.6(D) Q7.7(D) Q7.8(D) Q7.9(D) R2.2 U2.18(VS1)
M1_VS2: C2.1 D14.1 Q2.1(S) Q2.2(S) Q2.3(S) Q8.5(D) Q8.6(D) Q8.7(D) Q8.8(D) Q8.9(D) R3.2 U2.15(VS2)
M1_VS3: C5.1 D15.1 Q3.1(S) Q3.2(S) Q3.3(S) Q9.5(D) Q9.6(D) Q9.7(D) Q9.8(D) Q9.9(D) R4.2 U2.12(VS3)
M2_AIN: R13.1 R16.2 R20.2 U3.2(P0.0)
M2_BIN: R14.1 R17.2 R21.2 U3.20(P0.2)
M2_C: R16.1 R17.1 R19.1 U3.19(P0.3)
M2_C2CK: R18.2 U3.5(RSTB/C2CK) U11.1
M2_C2D: U3.6(P2.0/C2D) U16.1
M2_CIN: R15.1 R19.2 R22.2 U3.1(P0.1)
M2_HIN1: U3.14(P1.0) U4.22(HIN1)
M2_HIN2: U3.13(P1.1) U4.23(HIN2)
M2_HIN3: U3.11(P1.2) U4.24(HIN3)
M2_HO1: Q13.4(G) U4.19(HO1)
M2_HO2: Q14.4(G) U4.16(HO2)
M2_HO3: Q15.4(G) U4.13(HO3)
M2_LIN1: U3.10(P1.3) U4.1(LIN1)
M2_LIN2: U3.9(P1.4) U4.2(LIN2)
M2_LIN3: U3.8(P1.5) U4.3(LIN3)
M2_LO1: Q19.4(G) U4.11(LO1)
M2_LO2: Q20.4(G) U4.10(LO2)
M2_LO3: Q21.4(G) U4.9(LO3)
M2_PWM: R12.2 U27.9
M2_VB1: C6.2 D4.1(K) U4.20(VB1)
M2_VB2: C7.2 D5.1(K) U4.17(VB2)
M2_VB3: C10.2 D6.1(K) U4.14(VB3)
M2_VS1: C6.1 D19.1 Q13.1(S) Q13.2(S) Q13.3(S) Q19.5(D) Q19.6(D) Q19.7(D) Q19.8(D) Q19.9(D) R13.2 U4.18(VS1)
M2_VS2: C7.1 D20.1 Q14.1(S) Q14.2(S) Q14.3(S) Q20.5(D) Q20.6(D) Q20.7(D) Q20.8(D) Q20.9(D) R14.2 U4.15(VS2)
M2_VS3: C10.1 D21.1 Q15.1(S) Q15.2(S) Q15.3(S) Q21.5(D) Q21.6(D) Q21.7(D) Q21.8(D) Q21.9(D) R15.2 U4.12(VS3)
M3_AIN: R24.1 R27.2 R31.2 U5.2(P0.0)
M3_BIN: R25.1 R28.2 R32.2 U5.20(P0.2)
M3_C: R27.1 R28.1 R30.1 U5.19(P0.3)
M3_C2CK: R29.2 U5.5(RSTB/C2CK) U12.1
M3_C2D: U5.6(P2.0/C2D) U17.1
M3_CIN: R26.1 R30.2 R33.2 U5.1(P0.1)
M3_HIN1: U5.14(P1.0) U6.22(HIN1)
M3_HIN2: U5.13(P1.1) U6.23(HIN2)
M3_HIN3: U5.11(P1.2) U6.24(HIN3)
M3_HO1: Q4.4(G) U6.19(HO1)
M3_HO2: Q5.4(G) U6.16(HO2)
M3_HO3: Q6.4(G) U6.13(HO3)
M3_LIN1: U5.10(P1.3) U6.1(LIN1)
M3_LIN2: U5.9(P1.4) U6.2(LIN2)
M3_LIN3: U5.8(P1.5) U6.3(LIN3)
M3_LO1: Q10.4(G) U6.11(LO1)
M3_LO2: Q11.4(G) U6.10(LO2)
M3_LO3: Q12.4(G) U6.9(LO3)
M3_PWM: R23.2 U27.8
M3_VB1: C11.2 D7.1(K) U6.20(VB1)
M3_VB2: C12.2 D8.1(K) U6.17(VB2)
M3_VB3: C15.2 D9.1(K) U6.14(VB3)
M3_VS1: C11.1 D16.1 Q4.1(S) Q4.2(S) Q4.3(S) Q10.5(D) Q10.6(D) Q10.7(D) Q10.8(D) Q10.9(D) R24.2 U6.18(VS1)
M3_VS2: C12.1 D17.1 Q5.1(S) Q5.2(S) Q5.3(S) Q11.5(D) Q11.6(D) Q11.7(D) Q11.8(D) Q11.9(D) R25.2 U6.15(VS2)
M3_VS3: C15.1 D18.1 Q6.1(S) Q6.2(S) Q6.3(S) Q12.5(D) Q12.6(D) Q12.7(D) Q12.8(D) Q12.9(D) R26.2 U6.12(VS3)
M4_AIN: R35.1 R38.2 R42.2 U7.2(P0.0)
M4_BIN: R36.1 R39.2 R43.2 U7.20(P0.2)
M4_C: R38.1 R39.1 R41.1 U7.19(P0.3)
M4_C2CK: R40.2 U7.5(RSTB/C2CK) U13.1
M4_C2D: U7.6(P2.0/C2D) U18.1
M4_CIN: R37.1 R41.2 R44.2 U7.1(P0.1)
M4_HIN1: U7.14(P1.0) U8.22(HIN1)
M4_HIN2: U7.13(P1.1) U8.23(HIN2)
M4_HIN3: U7.11(P1.2) U8.24(HIN3)
M4_HO1: Q16.4(G) U8.19(HO1)
M4_HO2: Q17.4(G) U8.16(HO2)
M4_HO3: Q18.4(G) U8.13(HO3)
M4_LIN1: U7.10(P1.3) U8.1(LIN1)
M4_LIN2: U7.9(P1.4) U8.2(LIN2)
M4_LIN3: U7.8(P1.5) U8.3(LIN3)
M4_LO1: Q22.4(G) U8.11(LO1)
M4_LO2: Q23.4(G) U8.10(LO2)
M4_LO3: Q24.4(G) U8.9(LO3)
M4_PWM: R34.2 U27.7
M4_VB1: C16.2 D10.1(K) U8.20(VB1)
M4_VB2: C17.2 D11.1(K) U8.17(VB2)
M4_VB3: C20.2 D12.1(K) U8.14(VB3)
M4_VS1: C16.1 D22.1 Q16.1(S) Q16.2(S) Q16.3(S) Q22.5(D) Q22.6(D) Q22.7(D) Q22.8(D) Q22.9(D) R35.2 U8.18(VS1)
M4_VS2: C17.1 D23.1 Q17.1(S) Q17.2(S) Q17.3(S) Q23.5(D) Q23.6(D) Q23.7(D) Q23.8(D) Q23.9(D) R36.2 U8.15(VS2)
M4_VS3: C20.1 D24.1 Q18.1(S) Q18.2(S) Q18.3(S) Q24.5(D) Q24.6(D) Q24.7(D) Q24.8(D) Q24.9(D) R37.2 U8.12(VS3)
M5_PWM: U27.6
M6_PWM: U27.5
MISO4: U26.5
MOSI4: U26.4
PC13: U26.8
PD4: U26.10
PE10: U26.7
PE11: U25.7
PE13: U25.6
PE14: U26.6
PE15: U25.8
PH1: U26.9
RGB: LED1.4(DIN) LED10.4(DIN) U25.5
RX1: U35.2
RX2: U35.7
RX3: U27.3 U34.2
RX5: U34.6
RX7: U34.4
SBUS: U34.8
SCK4: U26.3
SCL2: U25.10
SDA2: U25.9
TX1: U35.3
TX2: U35.8
TX3: U34.3
TX5: U34.7
TX7: U34.5
VM: C22.2 C23.2 C31.2 R45.2 R49.1 U9.5(VIN) U19.5(IN-)
$1N9645: R1.1 U1.18(P0.4)
$1N9747: R12.1 U3.18(P0.4)
$1N9849: R23.1 U5.18(P0.4)
$1N9951: R34.1 U7.18(P0.4)
$1N15748: C21.2 U9.1(BST)
$1N20032: C21.1 L1.1 U9.6(SW)
$1N20137: R45.1 U9.4(EN)
$1N21202: R48.1 U19.6(OUT)
$2N5483: LED6.4(DIN) LED7.2(DOU)
$2N5486: LED7.4(DIN) LED8.2(DOU)
$2N5490: LED8.4(DIN) LED9.2(DOU)
$2N5494: LED9.4(DIN) LED10.2(DOU)
$2N5524: LED1.2(DOU) LED2.4(DIN)
$2N5542: LED3.2(DOU) LED4.4(DIN)
$2N5548: LED2.2(DOU) LED3.4(DIN)
$2N5554: LED4.2(DOU) LED5.4(DIN)

Not connected (* = marked no-connect by the designer): H1 1 2 3 4; H2 1 2 3 4; H3 1 2 3 4 5 6; LED5 2(DOU)*; LED6 2(DOU)*; U1 7(P1.6)* 15(P0.7)* 16(P0.6)* 17(P0.5)*; U2 5(NC)* 7(NC)* 8(NC)* 21(NC)*; U3 7(P1.6)* 15(P0.7)* 16(P0.6)* 17(P0.5)*; U4 5(NC)* 7(NC)* 8(NC)* 21(NC)*; U5 7(P1.6)* 15(P0.7)* 16(P0.6)* 17(P0.5)*; U6 5(NC)* 7(NC)* 8(NC)* 21(NC)*; U7 7(P1.6)* 15(P0.7)* 16(P0.6)* 17(P0.5)*; U8 5(NC)* 7(NC)* 8(NC)* 21(NC)*; U25 11 12; U26 11 12; U27 11 12; U34 11 12; U35 11 12
